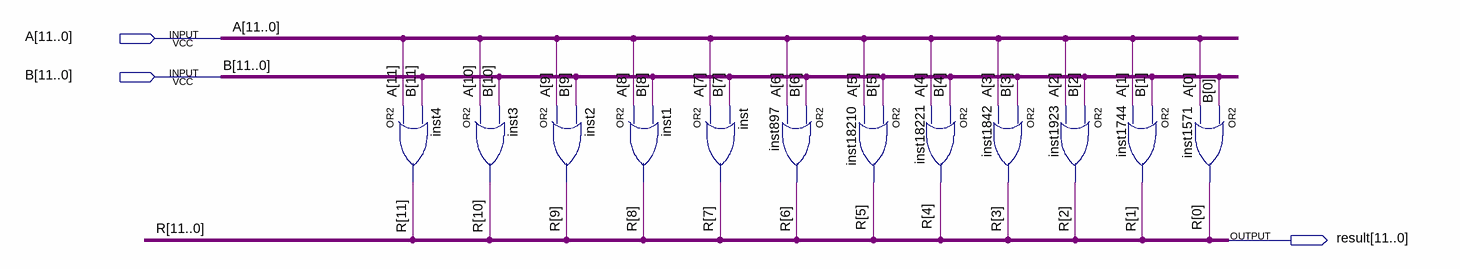
[diagram p0: schematic sheet]
// Quartus schematic Or_Mux_BCD.bdf as structural Verilog: 12 symbols, 3 pins
module Or_Mux_BCD (
  input  [11:0] A,
  input  [11:0] B,
  output [11:0] result
);

  or inst4 (result[11], A[11], B[11]);
  or inst3 (result[10], A[10], B[10]);
  or inst2 (result[9], A[9], B[9]);
  or inst1 (result[8], A[8], B[8]);
  or inst (result[7], A[7], B[7]);
  or inst897 (result[6], B[6], A[6]);
  or inst18210 (result[5], B[5], A[5]);
  or inst18221 (result[4], B[4], A[4]);
  or inst1842 (result[3], B[3], A[3]);
  or inst1923 (result[2], B[2], A[2]);
  or inst1744 (result[1], B[1], A[1]);
  or inst1571 (result[0], B[0], A[0]);

  // Other names for the same wires on the sheet: R[11:0] = result
endmodule
